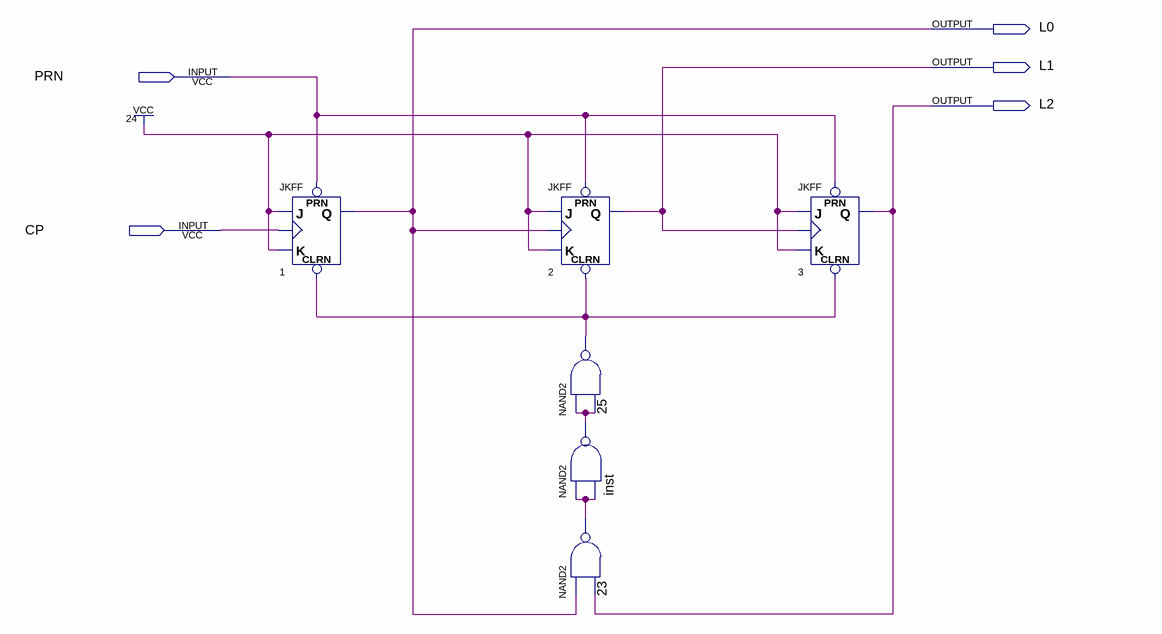
[diagram p0: schematic sheet]
// Quartus schematic fig12-19-1.bdf as structural Verilog: 6 symbols, 5 pins
module \fig12-19-1  (
  input  PRN,
  input  CP,
  output L0,
  output L1,
  output L2
);

  wire inst_out, n23_out, n25_out;

  JKFF u_1 (.PRN(PRN), .CLRN(n25_out), .K(1'b1), .J(1'b1), .CLK(CP), .Q(L0));
  JKFF u_2 (.PRN(PRN), .CLRN(n25_out), .K(1'b1), .J(1'b1), .CLK(L0), .Q(L1));
  nand u_25 (n25_out, inst_out, inst_out);
  nand inst (inst_out, n23_out, n23_out);
  nand u_23 (n23_out, L0, L2);
  JKFF u_3 (.PRN(PRN), .CLRN(n25_out), .K(1'b1), .J(1'b1), .CLK(L1), .Q(L2));
endmodule
